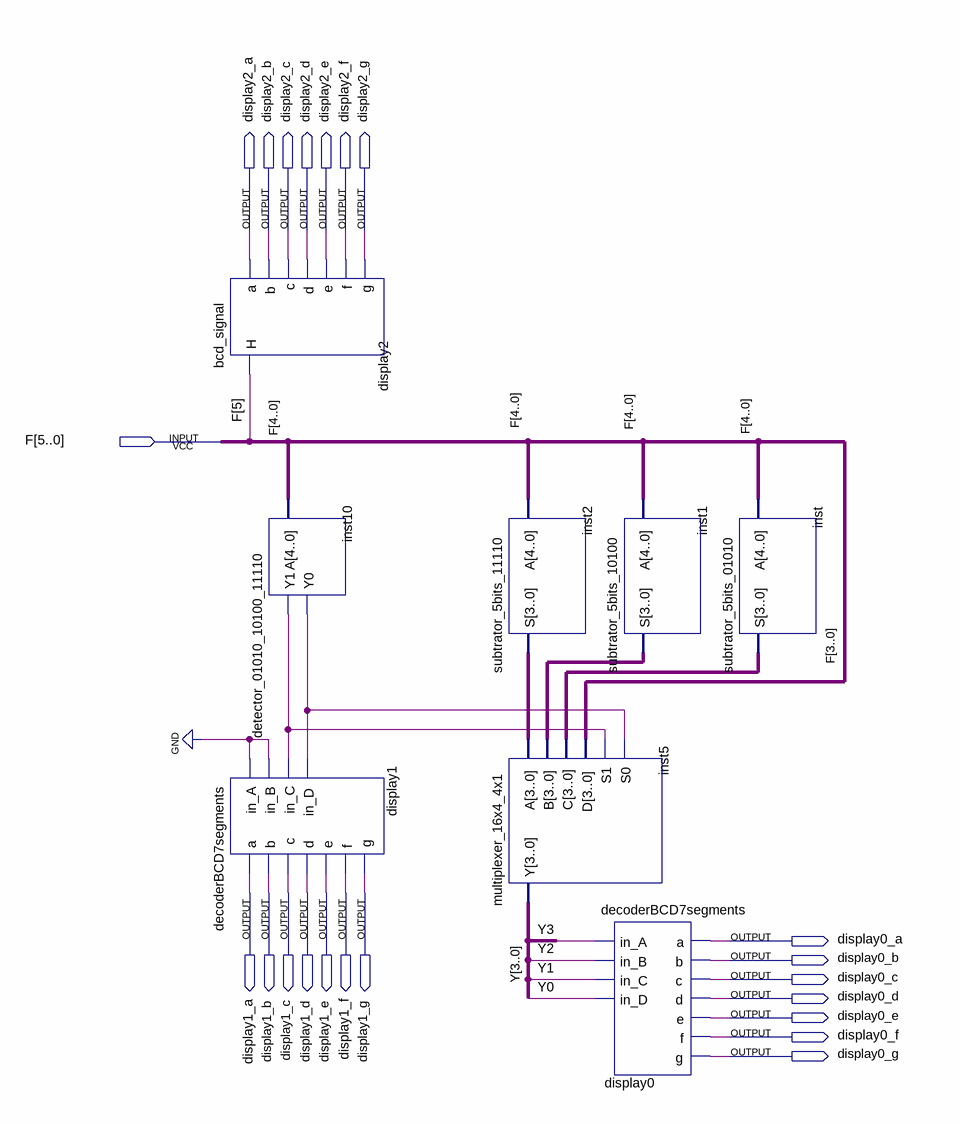
[diagram p0: schematic sheet]
// Quartus schematic DisplayOutput.bdf as structural Verilog: 8 symbols, 22 pins
module DisplayOutput (
  input  [5:0] F,
  output display2_a,
  output display2_b,
  output display2_c,
  output display2_d,
  output display2_e,
  output display2_f,
  output display2_g,
  output display1_a,
  output display1_b,
  output display1_c,
  output display1_d,
  output display1_e,
  output display1_f,
  output display1_g,
  output display0_a,
  output display0_b,
  output display0_c,
  output display0_d,
  output display0_e,
  output display0_f,
  output display0_g
);

  wire inst10_y0, inst10_y1;
  wire [3:0] inst1_s, inst2_s, inst_s, Y;

  bcd_signal display2 (
    .H(F[5]), .a(display2_a), .b(display2_b), .c(display2_c), .d(display2_d), .e(display2_e), .f(display2_f),
    .g(display2_g));
  detector_01010_10100_11110 inst10 (.A(F[4:0]), .Y1(inst10_y1), .Y0(inst10_y0));
  decoderBCD7segments display1 (
    .in_A(1'b0), .in_B(1'b0), .in_C(inst10_y1), .in_D(inst10_y0), .a(display1_a), .b(display1_b),
    .c(display1_c), .d(display1_d), .e(display1_e), .f(display1_f), .g(display1_g));
  subtrator_5bits_11110 inst2 (.A(F[4:0]), .S(inst2_s));
  multiplexer_16x4_4x1 inst5 (.A(inst2_s), .B(inst1_s), .C(inst_s), .D(F[3:0]), .S1(inst10_y1), .S0(inst10_y0), .Y(Y));
  subtrator_5bits_10100 inst1 (.A(F[4:0]), .S(inst1_s));
  decoderBCD7segments display0 (
    .in_A(Y[3]), .in_B(Y[2]), .in_C(Y[1]), .in_D(Y[0]), .a(display0_a), .b(display0_b), .c(display0_c),
    .d(display0_d), .e(display0_e), .f(display0_f), .g(display0_g));
  subtrator_5bits_01010 inst (.A(F[4:0]), .S(inst_s));
endmodule
